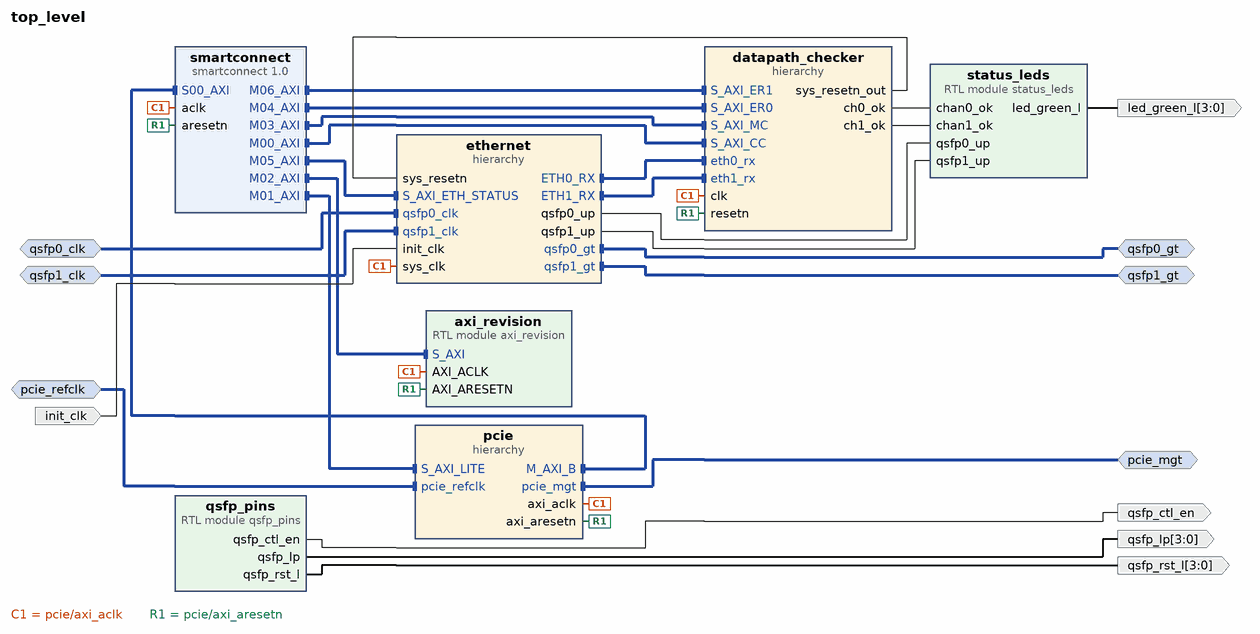
[diagram p0: block diagram of the top level]
# Vivado block design top_level, xcvu9p-flgb2104-3-e, Vivado 2021.1
create_bd_design top_level

create_bd_intf_port -mode Slave -vlnv xilinx.com:interface:diff_clock_rtl:1.0 pcie_refclk
create_bd_intf_port -mode Master -vlnv xilinx.com:interface:pcie_7x_mgt_rtl:1.0 pcie_mgt
create_bd_intf_port -mode Slave -vlnv xilinx.com:interface:diff_clock_rtl:1.0 qsfp0_clk
set_property -dict {CONFIG.FREQ_HZ 322265625} [get_bd_intf_ports qsfp0_clk]
create_bd_intf_port -mode Master -vlnv xilinx.com:interface:gt_rtl:1.0 qsfp0_gt
create_bd_intf_port -mode Master -vlnv xilinx.com:interface:gt_rtl:1.0 qsfp1_gt
create_bd_intf_port -mode Slave -vlnv xilinx.com:interface:diff_clock_rtl:1.0 qsfp1_clk
set_property -dict {CONFIG.FREQ_HZ 322265625} [get_bd_intf_ports qsfp1_clk]
create_bd_port -dir I -type clk init_clk
set_property -dict {CONFIG.FREQ_HZ 50000000} [get_bd_ports init_clk]
create_bd_port -dir O -from 3 -to 0 led_green_l
create_bd_port -dir O -from 3 -to 0 qsfp_rst_l
create_bd_port -dir O -from 3 -to 0 qsfp_lp
create_bd_port -dir O qsfp_ctl_en

create_bd_cell -type hier pcie
create_bd_cell -type hier ethernet
create_bd_cell -type hier datapath_checker
create_bd_cell -type module -reference axi_revision axi_revision
create_bd_cell -type ip -vlnv xilinx.com:ip:smartconnect:1.0 smartconnect
set_property -dict {CONFIG.NUM_CLKS 1 CONFIG.NUM_MI 7 CONFIG.NUM_SI 2} [get_bd_cells smartconnect]
create_bd_cell -type module -reference status_leds status_leds
create_bd_cell -type module -reference qsfp_pins qsfp_pins

# ---- hierarchy /pcie ----
current_bd_instance /pcie
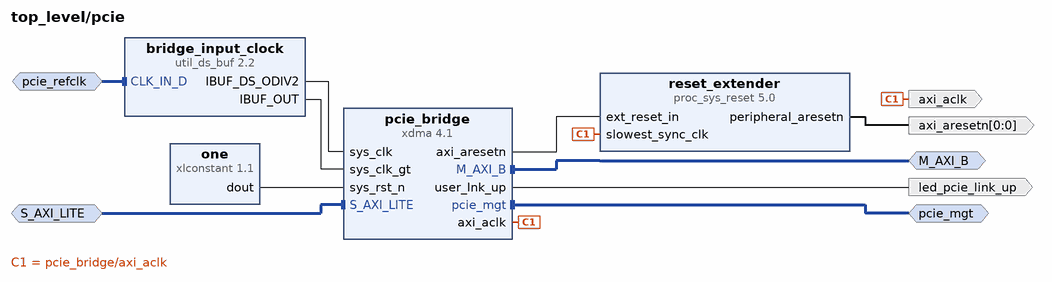
[diagram p1: block diagram inside /pcie]
create_bd_intf_pin -mode Master -vlnv xilinx.com:interface:aximm_rtl:1.0 M_AXI_B
create_bd_intf_pin -mode Slave -vlnv xilinx.com:interface:aximm_rtl:1.0 S_AXI_LITE
create_bd_intf_pin -mode Master -vlnv xilinx.com:interface:pcie_7x_mgt_rtl:1.0 pcie_mgt
create_bd_intf_pin -mode Slave -vlnv xilinx.com:interface:diff_clock_rtl:1.0 pcie_refclk
create_bd_pin -dir O led_pcie_link_up
create_bd_pin -dir O -type clk axi_aclk
create_bd_pin -dir O -from 0 -to 0 -type rst axi_aresetn

create_bd_cell -type ip -vlnv xilinx.com:ip:proc_sys_reset:5.0 reset_extender
create_bd_cell -type ip -vlnv xilinx.com:ip:util_ds_buf:2.2 bridge_input_clock
set_property -dict {CONFIG.C_BUF_TYPE IBUFDSGTE} [get_bd_cells bridge_input_clock]
create_bd_cell -type ip -vlnv xilinx.com:ip:xdma:4.1 pcie_bridge
set_property -dict [list \
  CONFIG.PF0_DEVICE_ID_mqdma 903F \
  CONFIG.PF0_SRIOV_VF_DEVICE_ID A03F \
  CONFIG.PF2_DEVICE_ID_mqdma 923F \
  CONFIG.PF3_DEVICE_ID_mqdma 933F \
  CONFIG.axi_addr_width 64 \
  CONFIG.axi_data_width 512_bit \
  CONFIG.axisten_freq 250 \
  CONFIG.bridge_burst true \
  CONFIG.dma_reset_source_sel User_Reset \
  CONFIG.en_axi_slave_if false \
  CONFIG.enable_jtag_dbg false \
  CONFIG.functional_mode AXI_Bridge \
  CONFIG.mode_selection Advanced \
  CONFIG.pcie_blk_locn X1Y2 \
  CONFIG.pf0_bar0_scale Megabytes \
  CONFIG.pf0_bar0_size 1 \
  CONFIG.pf0_bar1_enabled true \
  CONFIG.pf0_bar1_scale Megabytes \
  CONFIG.pf0_bar1_size 1 \
  CONFIG.pf0_device_id 903F \
  CONFIG.pl_link_cap_max_link_speed 8.0_GT/s \
  CONFIG.pl_link_cap_max_link_width X16 \
  CONFIG.plltype QPLL1 \
] [get_bd_cells pcie_bridge]
create_bd_cell -type ip -vlnv xilinx.com:ip:xlconstant:1.1 one

# ---- hierarchy /ethernet ----
current_bd_instance /ethernet
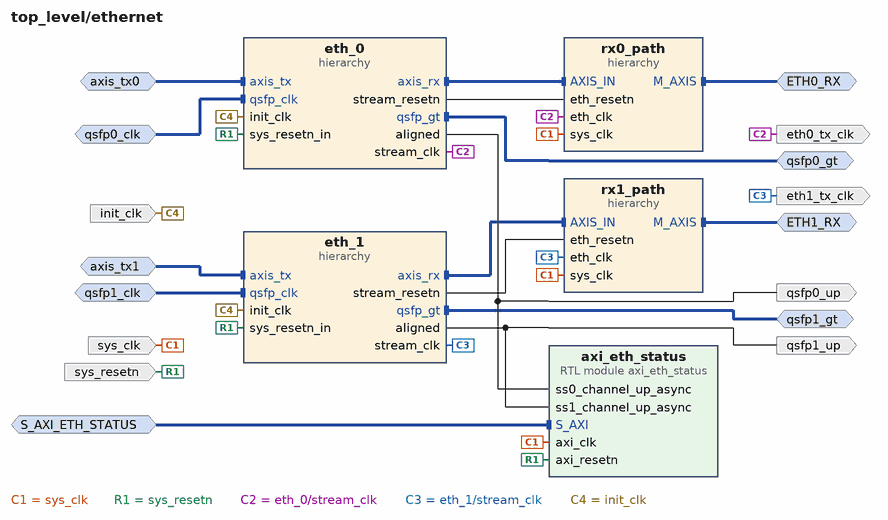
[diagram p2: block diagram inside /ethernet]
create_bd_intf_pin -mode Master -vlnv xilinx.com:interface:gt_rtl:1.0 qsfp1_gt
create_bd_intf_pin -mode Slave -vlnv xilinx.com:interface:diff_clock_rtl:1.0 qsfp1_clk
create_bd_intf_pin -mode Slave -vlnv xilinx.com:interface:axis_rtl:1.0 axis_tx1
create_bd_intf_pin -mode Master -vlnv xilinx.com:interface:gt_rtl:1.0 qsfp0_gt
create_bd_intf_pin -mode Slave -vlnv xilinx.com:interface:diff_clock_rtl:1.0 qsfp0_clk
create_bd_intf_pin -mode Slave -vlnv xilinx.com:interface:axis_rtl:1.0 axis_tx0
create_bd_intf_pin -mode Slave -vlnv xilinx.com:interface:aximm_rtl:1.0 S_AXI_ETH_STATUS
create_bd_intf_pin -mode Master -vlnv xilinx.com:interface:axis_rtl:1.0 ETH0_RX
create_bd_intf_pin -mode Master -vlnv xilinx.com:interface:axis_rtl:1.0 ETH1_RX
create_bd_pin -dir O -type clk eth1_tx_clk
create_bd_pin -dir O qsfp1_up
create_bd_pin -dir O -type clk eth0_tx_clk
create_bd_pin -dir O qsfp0_up
create_bd_pin -dir I sys_clk
create_bd_pin -dir I sys_resetn
create_bd_pin -dir I -type clk init_clk

create_bd_cell -type hier eth_1
create_bd_cell -type hier eth_0
create_bd_cell -type hier rx0_path
create_bd_cell -type hier rx1_path
create_bd_cell -type module -reference axi_eth_status axi_eth_status

# ---- hierarchy /ethernet/eth_1 ----
current_bd_instance /ethernet/eth_1
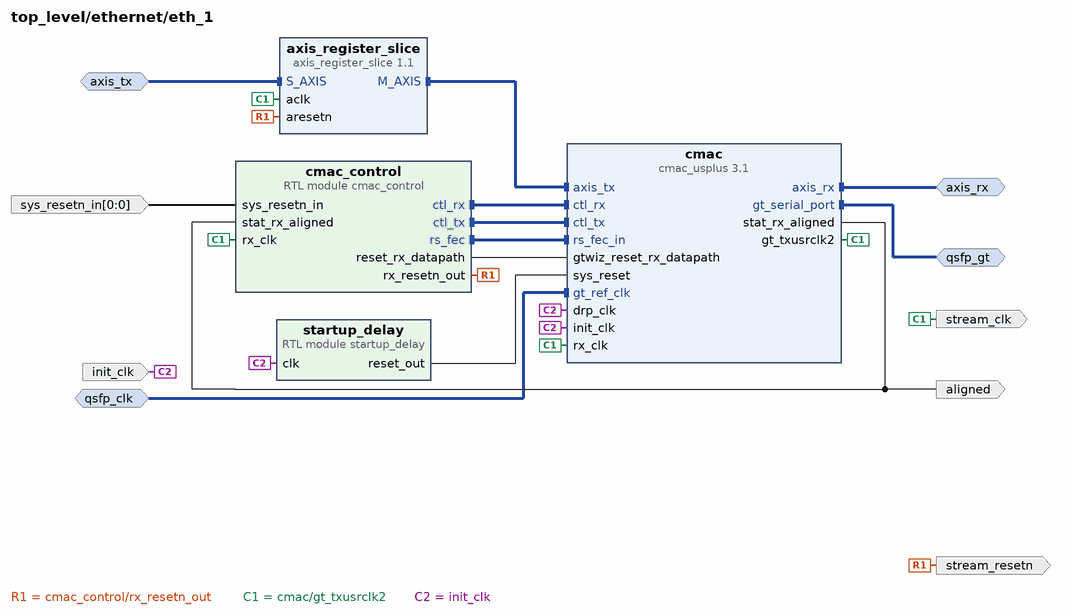
[diagram p3: block diagram inside /ethernet/eth_1]
create_bd_intf_pin -mode Master -vlnv xilinx.com:interface:gt_rtl:1.0 qsfp_gt
create_bd_intf_pin -mode Slave -vlnv xilinx.com:interface:diff_clock_rtl:1.0 qsfp_clk
create_bd_intf_pin -mode Slave -vlnv xilinx.com:interface:axis_rtl:1.0 axis_tx
create_bd_intf_pin -mode Master -vlnv xilinx.com:interface:axis_rtl:1.0 axis_rx
create_bd_pin -dir O -type clk stream_clk
create_bd_pin -dir O aligned
create_bd_pin -dir I init_clk
create_bd_pin -dir I -from 0 -to 0 sys_resetn_in
create_bd_pin -dir O stream_resetn

create_bd_cell -type ip -vlnv xilinx.com:ip:axis_register_slice:1.1 axis_register_slice
create_bd_cell -type ip -vlnv xilinx.com:ip:cmac_usplus:3.1 cmac
set_property -dict [list \
  CONFIG.CMAC_CAUI4_MODE 1 \
  CONFIG.CMAC_CORE_SELECT CMACE4_X0Y2 \
  CONFIG.GT_DRP_CLK 100 \
  CONFIG.GT_GROUP_SELECT {X0Y12~X0Y15} \
  CONFIG.GT_REF_CLK_FREQ 322.265625 \
  CONFIG.INCLUDE_RS_FEC 1 \
  CONFIG.NUM_LANES 4x25 \
  CONFIG.RX_FLOW_CONTROL 0 \
  CONFIG.RX_GT_BUFFER 1 \
  CONFIG.TX_FLOW_CONTROL 0 \
  CONFIG.USER_INTERFACE AXIS \
] [get_bd_cells cmac]
create_bd_cell -type module -reference cmac_control cmac_control
create_bd_cell -type module -reference startup_delay startup_delay

# ---- hierarchy /ethernet/eth_0 ----
current_bd_instance /ethernet/eth_0
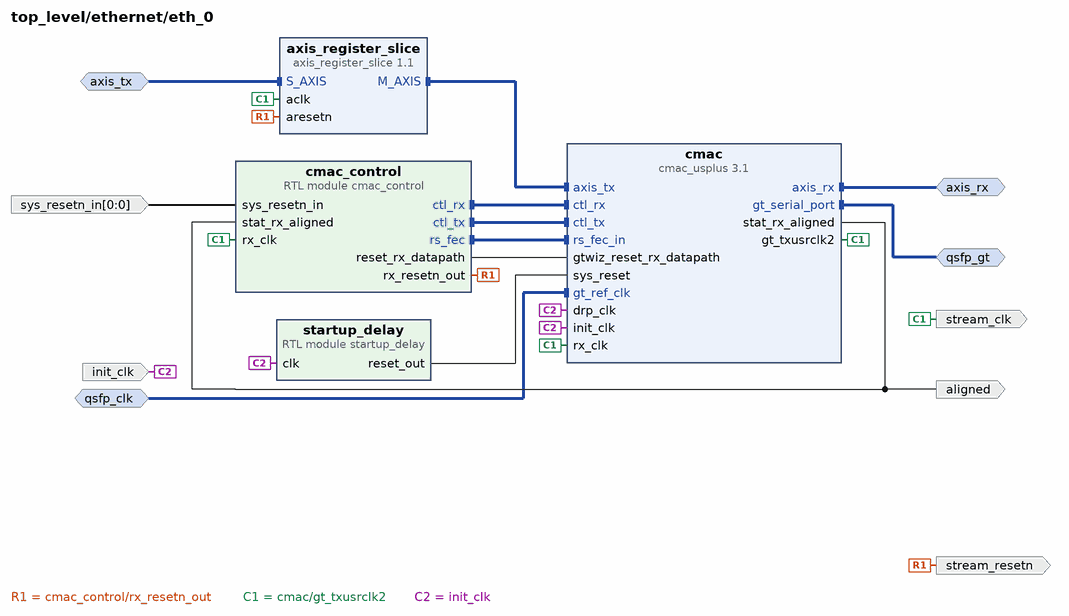
[diagram p4: block diagram inside /ethernet/eth_0]
create_bd_intf_pin -mode Master -vlnv xilinx.com:interface:gt_rtl:1.0 qsfp_gt
create_bd_intf_pin -mode Slave -vlnv xilinx.com:interface:diff_clock_rtl:1.0 qsfp_clk
create_bd_intf_pin -mode Slave -vlnv xilinx.com:interface:axis_rtl:1.0 axis_tx
create_bd_intf_pin -mode Master -vlnv xilinx.com:interface:axis_rtl:1.0 axis_rx
create_bd_pin -dir O -type clk stream_clk
create_bd_pin -dir O aligned
create_bd_pin -dir I -type clk init_clk
create_bd_pin -dir I -from 0 -to 0 sys_resetn_in
create_bd_pin -dir O stream_resetn

create_bd_cell -type ip -vlnv xilinx.com:ip:axis_register_slice:1.1 axis_register_slice
create_bd_cell -type module -reference cmac_control cmac_control
create_bd_cell -type ip -vlnv xilinx.com:ip:cmac_usplus:3.1 cmac
set_property -dict [list \
  CONFIG.CMAC_CAUI4_MODE 1 \
  CONFIG.CMAC_CORE_SELECT CMACE4_X0Y1 \
  CONFIG.GT_DRP_CLK 50 \
  CONFIG.GT_GROUP_SELECT {X0Y4~X0Y7} \
  CONFIG.GT_REF_CLK_FREQ 322.265625 \
  CONFIG.INCLUDE_RS_FEC 1 \
  CONFIG.NUM_LANES 4x25 \
  CONFIG.RX_FLOW_CONTROL 0 \
  CONFIG.RX_GT_BUFFER 1 \
  CONFIG.TX_FLOW_CONTROL 0 \
  CONFIG.USER_INTERFACE AXIS \
] [get_bd_cells cmac]
create_bd_cell -type module -reference startup_delay startup_delay

# ---- hierarchy /ethernet/rx0_path ----
current_bd_instance /ethernet/rx0_path
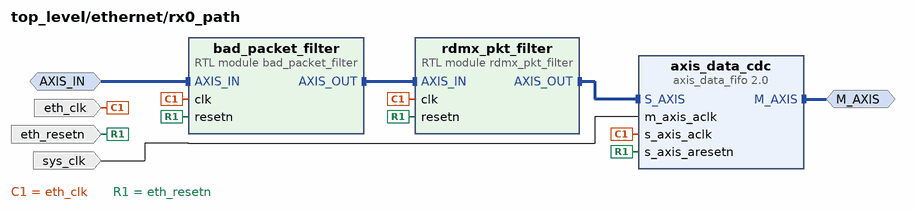
[diagram p5: block diagram inside /ethernet/rx0_path]
create_bd_intf_pin -mode Slave -vlnv xilinx.com:interface:axis_rtl:1.0 AXIS_IN
create_bd_intf_pin -mode Master -vlnv xilinx.com:interface:axis_rtl:1.0 M_AXIS
create_bd_pin -dir I eth_clk
create_bd_pin -dir I eth_resetn
create_bd_pin -dir I sys_clk

create_bd_cell -type ip -vlnv xilinx.com:ip:axis_data_fifo:2.0 axis_data_cdc
set_property -dict {CONFIG.FIFO_DEPTH 256 CONFIG.IS_ACLK_ASYNC 1} [get_bd_cells axis_data_cdc]
create_bd_cell -type module -reference bad_packet_filter bad_packet_filter
set_property -dict {CONFIG.MARK_ONLY_MODE 1} [get_bd_cells bad_packet_filter]
create_bd_cell -type module -reference rdmx_pkt_filter rdmx_pkt_filter

# ---- hierarchy /ethernet/rx1_path ----
current_bd_instance /ethernet/rx1_path
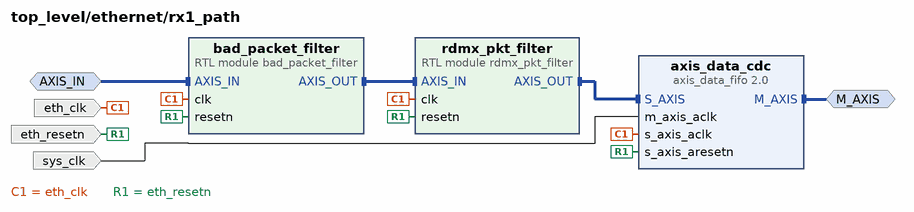
[diagram p6: block diagram inside /ethernet/rx1_path]
create_bd_intf_pin -mode Slave -vlnv xilinx.com:interface:axis_rtl:1.0 AXIS_IN
create_bd_intf_pin -mode Master -vlnv xilinx.com:interface:axis_rtl:1.0 M_AXIS
create_bd_pin -dir I eth_clk
create_bd_pin -dir I eth_resetn
create_bd_pin -dir I sys_clk

create_bd_cell -type ip -vlnv xilinx.com:ip:axis_data_fifo:2.0 axis_data_cdc
set_property -dict {CONFIG.FIFO_DEPTH 256 CONFIG.IS_ACLK_ASYNC 1} [get_bd_cells axis_data_cdc]
create_bd_cell -type module -reference bad_packet_filter bad_packet_filter
set_property -dict {CONFIG.MARK_ONLY_MODE 1} [get_bd_cells bad_packet_filter]
create_bd_cell -type module -reference rdmx_pkt_filter rdmx_pkt_filter

# ---- hierarchy /datapath_checker ----
current_bd_instance /datapath_checker
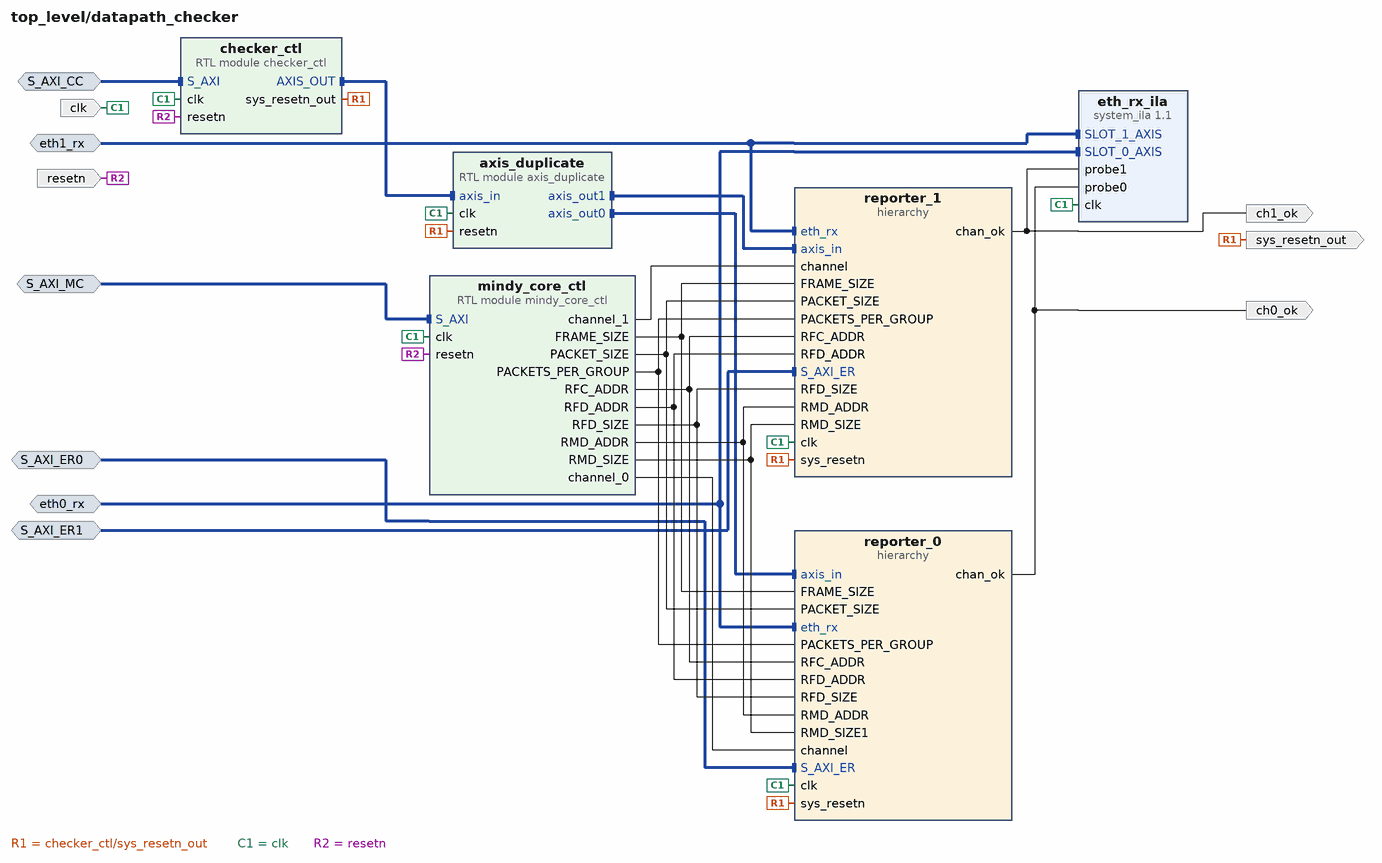
[diagram p7: block diagram inside /datapath_checker]
create_bd_intf_pin -mode Slave -vlnv xilinx.com:interface:aximm_rtl:1.0 S_AXI_CC
create_bd_intf_pin -mode Slave -vlnv xilinx.com:interface:axis_rtl:1.0 eth0_rx
create_bd_intf_pin -mode Slave -vlnv xilinx.com:interface:axis_rtl:1.0 eth1_rx
create_bd_intf_pin -mode Slave -vlnv xilinx.com:interface:aximm_rtl:1.0 S_AXI_MC
create_bd_intf_pin -mode Slave -vlnv xilinx.com:interface:aximm_rtl:1.0 S_AXI_ER0
create_bd_intf_pin -mode Slave -vlnv xilinx.com:interface:aximm_rtl:1.0 S_AXI_ER1
create_bd_pin -dir I -type clk clk
create_bd_pin -dir I -type rst resetn
create_bd_pin -dir O sys_resetn_out
create_bd_pin -dir O ch0_ok
create_bd_pin -dir O ch1_ok

create_bd_cell -type hier reporter_0
create_bd_cell -type hier reporter_1
create_bd_cell -type module -reference axis_duplicate axis_duplicate
create_bd_cell -type module -reference checker_ctl checker_ctl
create_bd_cell -type module -reference mindy_core_ctl mindy_core_ctl
create_bd_cell -type ip -vlnv xilinx.com:ip:system_ila:1.1 eth_rx_ila
set_property -dict [list \
  CONFIG.C_DATA_DEPTH 2048 \
  CONFIG.C_MON_TYPE MIX \
  CONFIG.C_NUM_MONITOR_SLOTS 2 \
  CONFIG.C_NUM_OF_PROBES 2 \
  CONFIG.C_SLOT 1 \
  CONFIG.C_SLOT_0_INTF_TYPE xilinx.com:interface:axis_rtl:1.0 \
  CONFIG.C_SLOT_1_INTF_TYPE xilinx.com:interface:axis_rtl:1.0 \
] [get_bd_cells eth_rx_ila]

# ---- hierarchy /datapath_checker/reporter_0 ----
current_bd_instance /datapath_checker/reporter_0
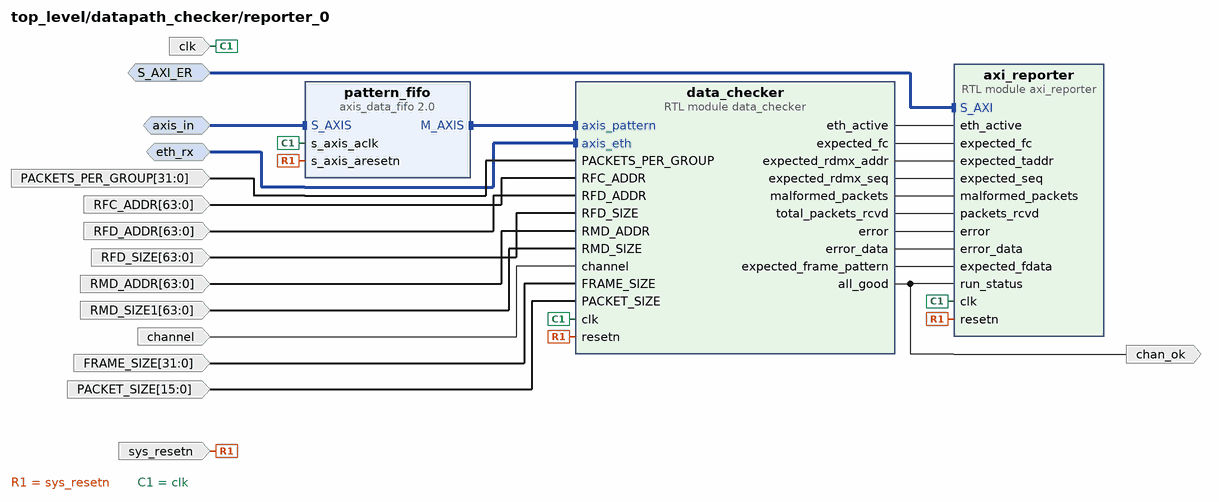
[diagram p8: block diagram inside /datapath_checker/reporter_0]
create_bd_intf_pin -mode Slave -vlnv xilinx.com:interface:axis_rtl:1.0 eth_rx
create_bd_intf_pin -mode Slave -vlnv xilinx.com:interface:axis_rtl:1.0 axis_in
create_bd_intf_pin -mode Slave -vlnv xilinx.com:interface:aximm_rtl:1.0 S_AXI_ER
create_bd_pin -dir I -type clk clk
create_bd_pin -dir O chan_ok
create_bd_pin -dir I sys_resetn
create_bd_pin -dir I -from 15 -to 0 PACKET_SIZE
create_bd_pin -dir I -from 31 -to 0 FRAME_SIZE
create_bd_pin -dir I -from 63 -to 0 RFD_ADDR
create_bd_pin -dir I -from 63 -to 0 RFD_SIZE
create_bd_pin -dir I -from 63 -to 0 RMD_ADDR
create_bd_pin -dir I -from 63 -to 0 RMD_SIZE1
create_bd_pin -dir I -from 63 -to 0 RFC_ADDR
create_bd_pin -dir I -from 31 -to 0 PACKETS_PER_GROUP
create_bd_pin -dir I channel

create_bd_cell -type module -reference axi_reporter axi_reporter
create_bd_cell -type ip -vlnv xilinx.com:ip:axis_data_fifo:2.0 pattern_fifo
create_bd_cell -type module -reference data_checker data_checker

# ---- hierarchy /datapath_checker/reporter_1 ----
current_bd_instance /datapath_checker/reporter_1
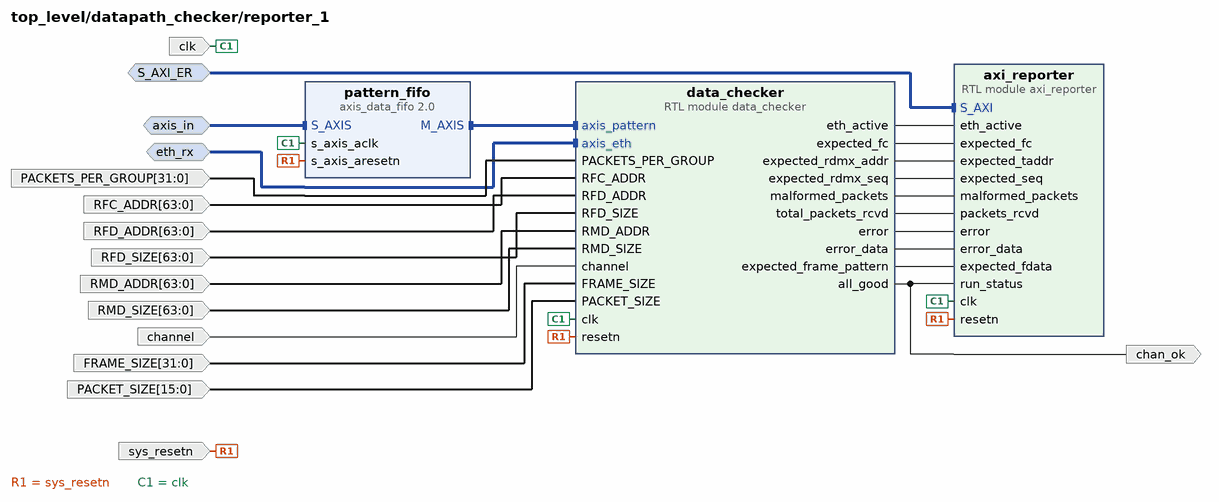
[diagram p9: block diagram inside /datapath_checker/reporter_1]
create_bd_intf_pin -mode Slave -vlnv xilinx.com:interface:axis_rtl:1.0 eth_rx
create_bd_intf_pin -mode Slave -vlnv xilinx.com:interface:axis_rtl:1.0 axis_in
create_bd_intf_pin -mode Slave -vlnv xilinx.com:interface:aximm_rtl:1.0 S_AXI_ER
create_bd_pin -dir I -type clk clk
create_bd_pin -dir O chan_ok
create_bd_pin -dir I sys_resetn
create_bd_pin -dir I -from 15 -to 0 PACKET_SIZE
create_bd_pin -dir I -from 31 -to 0 FRAME_SIZE
create_bd_pin -dir I -from 63 -to 0 RFD_ADDR
create_bd_pin -dir I -from 63 -to 0 RFD_SIZE
create_bd_pin -dir I -from 63 -to 0 RMD_ADDR
create_bd_pin -dir I -from 63 -to 0 RMD_SIZE
create_bd_pin -dir I -from 63 -to 0 RFC_ADDR
create_bd_pin -dir I -from 31 -to 0 PACKETS_PER_GROUP
create_bd_pin -dir I channel

create_bd_cell -type module -reference axi_reporter axi_reporter
create_bd_cell -type module -reference data_checker data_checker
create_bd_cell -type ip -vlnv xilinx.com:ip:axis_data_fifo:2.0 pattern_fifo

# ---- connections ----

current_bd_instance /pcie
connect_bd_intf_net [get_bd_intf_pins pcie_refclk] [get_bd_intf_pins bridge_input_clock/CLK_IN_D]
connect_bd_intf_net [get_bd_intf_pins S_AXI_LITE] [get_bd_intf_pins pcie_bridge/S_AXI_LITE]
connect_bd_intf_net [get_bd_intf_pins M_AXI_B] [get_bd_intf_pins pcie_bridge/M_AXI_B]
connect_bd_intf_net [get_bd_intf_pins pcie_mgt] [get_bd_intf_pins pcie_bridge/pcie_mgt]
connect_bd_net [get_bd_pins bridge_input_clock/IBUF_DS_ODIV2] [get_bd_pins pcie_bridge/sys_clk]
connect_bd_net [get_bd_pins bridge_input_clock/IBUF_OUT] [get_bd_pins pcie_bridge/sys_clk_gt]
connect_bd_net [get_bd_pins one/dout] [get_bd_pins pcie_bridge/sys_rst_n]
connect_bd_net [get_bd_pins pcie_bridge/axi_aresetn] [get_bd_pins reset_extender/ext_reset_in]
connect_bd_net -net proc_sys_reset_0_peripheral_aresetn [get_bd_pins reset_extender/peripheral_aresetn] [get_bd_pins axi_aresetn]
connect_bd_net -net xdma_0_axi_aclk [get_bd_pins pcie_bridge/axi_aclk] [get_bd_pins axi_aclk] [get_bd_pins reset_extender/slowest_sync_clk]
connect_bd_net -net xdma_0_user_lnk_up [get_bd_pins pcie_bridge/user_lnk_up] [get_bd_pins led_pcie_link_up]

current_bd_instance /ethernet
connect_bd_intf_net [get_bd_intf_pins S_AXI_ETH_STATUS] [get_bd_intf_pins axi_eth_status/S_AXI]
connect_bd_intf_net [get_bd_intf_pins axis_tx0] [get_bd_intf_pins eth_0/axis_tx]
connect_bd_intf_net [get_bd_intf_pins axis_tx1] [get_bd_intf_pins eth_1/axis_tx]
connect_bd_intf_net [get_bd_intf_pins qsfp0_gt] [get_bd_intf_pins eth_0/qsfp_gt]
connect_bd_intf_net [get_bd_intf_pins rx0_path/AXIS_IN] [get_bd_intf_pins eth_0/axis_rx]
connect_bd_intf_net [get_bd_intf_pins rx1_path/AXIS_IN] [get_bd_intf_pins eth_1/axis_rx]
connect_bd_intf_net [get_bd_intf_pins qsfp1_gt] [get_bd_intf_pins eth_1/qsfp_gt]
connect_bd_intf_net [get_bd_intf_pins qsfp0_clk] [get_bd_intf_pins eth_0/qsfp_clk]
connect_bd_intf_net [get_bd_intf_pins qsfp1_clk] [get_bd_intf_pins eth_1/qsfp_clk]
connect_bd_intf_net [get_bd_intf_pins ETH0_RX] [get_bd_intf_pins rx0_path/M_AXIS]
connect_bd_intf_net [get_bd_intf_pins ETH1_RX] [get_bd_intf_pins rx1_path/M_AXIS]
connect_bd_net -net axi_clk_1 [get_bd_pins sys_clk] [get_bd_pins rx0_path/sys_clk] [get_bd_pins rx1_path/sys_clk] [get_bd_pins axi_eth_status/axi_clk]
connect_bd_net -net axi_resetn_1 [get_bd_pins sys_resetn] \
  [get_bd_pins eth_0/sys_resetn_in] [get_bd_pins eth_1/sys_resetn_in] [get_bd_pins axi_eth_status/axi_resetn]
connect_bd_net -net eth_0_stat_rx_aligned_0 [get_bd_pins eth_0/aligned] [get_bd_pins qsfp0_up] [get_bd_pins axi_eth_status/ss0_channel_up_async]
connect_bd_net [get_bd_pins eth_0/stream_clk] [get_bd_pins eth0_tx_clk] [get_bd_pins rx0_path/eth_clk]
connect_bd_net [get_bd_pins eth_0/stream_resetn] [get_bd_pins rx0_path/eth_resetn]
connect_bd_net -net eth_1_stat_rx_aligned_0 [get_bd_pins eth_1/aligned] [get_bd_pins qsfp1_up] [get_bd_pins axi_eth_status/ss1_channel_up_async]
connect_bd_net [get_bd_pins eth_1/stream_clk] [get_bd_pins eth1_tx_clk] [get_bd_pins rx1_path/eth_clk]
connect_bd_net [get_bd_pins eth_1/stream_resetn] [get_bd_pins rx1_path/eth_resetn]
connect_bd_net -net init_clk_0_1 [get_bd_pins init_clk] [get_bd_pins eth_0/init_clk] [get_bd_pins eth_1/init_clk]

current_bd_instance /ethernet/eth_1
connect_bd_intf_net [get_bd_intf_pins axis_register_slice/M_AXIS] [get_bd_intf_pins cmac/axis_tx]
connect_bd_intf_net [get_bd_intf_pins axis_tx] [get_bd_intf_pins axis_register_slice/S_AXIS]
connect_bd_intf_net [get_bd_intf_pins cmac_control/ctl_rx] [get_bd_intf_pins cmac/ctl_rx]
connect_bd_intf_net [get_bd_intf_pins cmac_control/ctl_tx] [get_bd_intf_pins cmac/ctl_tx]
connect_bd_intf_net [get_bd_intf_pins cmac_control/rs_fec] [get_bd_intf_pins cmac/rs_fec_in]
connect_bd_intf_net [get_bd_intf_pins axis_rx] [get_bd_intf_pins cmac/axis_rx]
connect_bd_intf_net [get_bd_intf_pins qsfp_gt] [get_bd_intf_pins cmac/gt_serial_port]
connect_bd_intf_net [get_bd_intf_pins qsfp_clk] [get_bd_intf_pins cmac/gt_ref_clk]
connect_bd_net [get_bd_pins cmac_control/reset_rx_datapath] [get_bd_pins cmac/gtwiz_reset_rx_datapath]
connect_bd_net -net cmac_control_sys_resetn_out [get_bd_pins cmac_control/rx_resetn_out] \
  [get_bd_pins stream_resetn] [get_bd_pins axis_register_slice/aresetn]
connect_bd_net -net cmac_gt_rxusrclk2 [get_bd_pins cmac/gt_txusrclk2] \
  [get_bd_pins stream_clk] [get_bd_pins axis_register_slice/aclk] [get_bd_pins cmac/rx_clk] [get_bd_pins cmac_control/rx_clk]
connect_bd_net [get_bd_pins cmac/stat_rx_aligned] [get_bd_pins aligned] [get_bd_pins cmac_control/stat_rx_aligned]
connect_bd_net [get_bd_pins init_clk] [get_bd_pins cmac/init_clk] [get_bd_pins cmac/drp_clk] [get_bd_pins startup_delay/clk]
connect_bd_net [get_bd_pins startup_delay/reset_out] [get_bd_pins cmac/sys_reset]
connect_bd_net [get_bd_pins sys_resetn_in] [get_bd_pins cmac_control/sys_resetn_in]

current_bd_instance /ethernet/eth_0
connect_bd_intf_net [get_bd_intf_pins axis_register_slice/M_AXIS] [get_bd_intf_pins cmac/axis_tx]
connect_bd_intf_net [get_bd_intf_pins axis_tx] [get_bd_intf_pins axis_register_slice/S_AXIS]
connect_bd_intf_net [get_bd_intf_pins cmac_control/ctl_rx] [get_bd_intf_pins cmac/ctl_rx]
connect_bd_intf_net [get_bd_intf_pins cmac_control/ctl_tx] [get_bd_intf_pins cmac/ctl_tx]
connect_bd_intf_net [get_bd_intf_pins cmac_control/rs_fec] [get_bd_intf_pins cmac/rs_fec_in]
connect_bd_intf_net [get_bd_intf_pins axis_rx] [get_bd_intf_pins cmac/axis_rx]
connect_bd_intf_net [get_bd_intf_pins qsfp_gt] [get_bd_intf_pins cmac/gt_serial_port]
connect_bd_intf_net [get_bd_intf_pins qsfp_clk] [get_bd_intf_pins cmac/gt_ref_clk]
connect_bd_net [get_bd_pins cmac_control/reset_rx_datapath] [get_bd_pins cmac/gtwiz_reset_rx_datapath]
connect_bd_net -net cmac_control_sys_resetn_out [get_bd_pins cmac_control/rx_resetn_out] \
  [get_bd_pins stream_resetn] [get_bd_pins axis_register_slice/aresetn]
connect_bd_net -net cmac_gt_rxusrclk2 [get_bd_pins cmac/gt_txusrclk2] \
  [get_bd_pins stream_clk] [get_bd_pins axis_register_slice/aclk] [get_bd_pins cmac_control/rx_clk] [get_bd_pins cmac/rx_clk]
connect_bd_net [get_bd_pins cmac/stat_rx_aligned] [get_bd_pins aligned] [get_bd_pins cmac_control/stat_rx_aligned]
connect_bd_net -net init_clk_0_1 [get_bd_pins init_clk] [get_bd_pins cmac/init_clk] [get_bd_pins cmac/drp_clk] [get_bd_pins startup_delay/clk]
connect_bd_net [get_bd_pins startup_delay/reset_out] [get_bd_pins cmac/sys_reset]
connect_bd_net [get_bd_pins sys_resetn_in] [get_bd_pins cmac_control/sys_resetn_in]

current_bd_instance /ethernet/rx0_path
connect_bd_intf_net [get_bd_intf_pins AXIS_IN] [get_bd_intf_pins bad_packet_filter/AXIS_IN]
connect_bd_intf_net [get_bd_intf_pins M_AXIS] [get_bd_intf_pins axis_data_cdc/M_AXIS]
connect_bd_intf_net [get_bd_intf_pins bad_packet_filter/AXIS_OUT] [get_bd_intf_pins rdmx_pkt_filter/AXIS_IN]
connect_bd_intf_net [get_bd_intf_pins axis_data_cdc/S_AXIS] [get_bd_intf_pins rdmx_pkt_filter/AXIS_OUT]
connect_bd_net -net clk_1 [get_bd_pins eth_clk] \
  [get_bd_pins axis_data_cdc/s_axis_aclk] [get_bd_pins bad_packet_filter/clk] [get_bd_pins rdmx_pkt_filter/clk]
connect_bd_net -net resetn_cdc_dest_arst [get_bd_pins eth_resetn] \
  [get_bd_pins axis_data_cdc/s_axis_aresetn] [get_bd_pins bad_packet_filter/resetn] [get_bd_pins rdmx_pkt_filter/resetn]
connect_bd_net [get_bd_pins sys_clk] [get_bd_pins axis_data_cdc/m_axis_aclk]

current_bd_instance /ethernet/rx1_path
connect_bd_intf_net [get_bd_intf_pins AXIS_IN] [get_bd_intf_pins bad_packet_filter/AXIS_IN]
connect_bd_intf_net [get_bd_intf_pins M_AXIS] [get_bd_intf_pins axis_data_cdc/M_AXIS]
connect_bd_intf_net [get_bd_intf_pins bad_packet_filter/AXIS_OUT] [get_bd_intf_pins rdmx_pkt_filter/AXIS_IN]
connect_bd_intf_net [get_bd_intf_pins axis_data_cdc/S_AXIS] [get_bd_intf_pins rdmx_pkt_filter/AXIS_OUT]
connect_bd_net -net clk_1 [get_bd_pins eth_clk] \
  [get_bd_pins axis_data_cdc/s_axis_aclk] [get_bd_pins bad_packet_filter/clk] [get_bd_pins rdmx_pkt_filter/clk]
connect_bd_net -net resetn_cdc_dest_arst [get_bd_pins eth_resetn] \
  [get_bd_pins axis_data_cdc/s_axis_aresetn] [get_bd_pins bad_packet_filter/resetn] [get_bd_pins rdmx_pkt_filter/resetn]
connect_bd_net [get_bd_pins sys_clk] [get_bd_pins axis_data_cdc/m_axis_aclk]

current_bd_instance /datapath_checker
connect_bd_intf_net [get_bd_intf_pins S_AXI_ER1] [get_bd_intf_pins reporter_1/S_AXI_ER]
connect_bd_intf_net [get_bd_intf_pins S_AXI_ER0] [get_bd_intf_pins reporter_0/S_AXI_ER]
connect_bd_intf_net [get_bd_intf_pins S_AXI_MC] [get_bd_intf_pins mindy_core_ctl/S_AXI]
connect_bd_intf_net [get_bd_intf_pins axis_duplicate/axis_out0] [get_bd_intf_pins reporter_0/axis_in]
connect_bd_intf_net [get_bd_intf_pins axis_duplicate/axis_out1] [get_bd_intf_pins reporter_1/axis_in]
connect_bd_intf_net [get_bd_intf_pins eth0_rx] [get_bd_intf_pins reporter_0/eth_rx]
connect_bd_intf_net [get_bd_intf_pins eth0_rx] [get_bd_intf_pins eth_rx_ila/SLOT_0_AXIS]
connect_bd_intf_net [get_bd_intf_pins eth1_rx] [get_bd_intf_pins reporter_1/eth_rx]
connect_bd_intf_net [get_bd_intf_pins eth1_rx] [get_bd_intf_pins eth_rx_ila/SLOT_1_AXIS]
connect_bd_intf_net [get_bd_intf_pins axis_duplicate/axis_in] [get_bd_intf_pins checker_ctl/AXIS_OUT]
connect_bd_intf_net [get_bd_intf_pins S_AXI_CC] [get_bd_intf_pins checker_ctl/S_AXI]
connect_bd_net -net ch0_ok [get_bd_pins reporter_0/chan_ok] [get_bd_pins ch0_ok] [get_bd_pins eth_rx_ila/probe0]
connect_bd_net -net ch1_ok [get_bd_pins reporter_1/chan_ok] [get_bd_pins ch1_ok] [get_bd_pins eth_rx_ila/probe1]
connect_bd_net [get_bd_pins checker_ctl/sys_resetn_out] \
  [get_bd_pins sys_resetn_out] [get_bd_pins reporter_0/sys_resetn] [get_bd_pins reporter_1/sys_resetn] \
  [get_bd_pins axis_duplicate/resetn]
connect_bd_net -net mindy_core_ctl_0_FRAME_SIZE [get_bd_pins mindy_core_ctl/FRAME_SIZE] \
  [get_bd_pins reporter_0/FRAME_SIZE] [get_bd_pins reporter_1/FRAME_SIZE]
connect_bd_net -net mindy_core_ctl_0_PACKET_SIZE [get_bd_pins mindy_core_ctl/PACKET_SIZE] \
  [get_bd_pins reporter_0/PACKET_SIZE] [get_bd_pins reporter_1/PACKET_SIZE]
connect_bd_net [get_bd_pins mindy_core_ctl/PACKETS_PER_GROUP] [get_bd_pins reporter_0/PACKETS_PER_GROUP] [get_bd_pins reporter_1/PACKETS_PER_GROUP]
connect_bd_net [get_bd_pins mindy_core_ctl/RFC_ADDR] [get_bd_pins reporter_0/RFC_ADDR] [get_bd_pins reporter_1/RFC_ADDR]
connect_bd_net [get_bd_pins mindy_core_ctl/RFD_ADDR] [get_bd_pins reporter_0/RFD_ADDR] [get_bd_pins reporter_1/RFD_ADDR]
connect_bd_net [get_bd_pins mindy_core_ctl/RFD_SIZE] [get_bd_pins reporter_0/RFD_SIZE] [get_bd_pins reporter_1/RFD_SIZE]
connect_bd_net [get_bd_pins mindy_core_ctl/RMD_ADDR] [get_bd_pins reporter_0/RMD_ADDR] [get_bd_pins reporter_1/RMD_ADDR]
connect_bd_net [get_bd_pins mindy_core_ctl/RMD_SIZE] [get_bd_pins reporter_0/RMD_SIZE1] [get_bd_pins reporter_1/RMD_SIZE]
connect_bd_net [get_bd_pins mindy_core_ctl/channel_0] [get_bd_pins reporter_0/channel]
connect_bd_net [get_bd_pins mindy_core_ctl/channel_1] [get_bd_pins reporter_1/channel]
connect_bd_net -net pcie_axi_aclk [get_bd_pins clk] \
  [get_bd_pins reporter_0/clk] [get_bd_pins reporter_1/clk] [get_bd_pins axis_duplicate/clk] [get_bd_pins checker_ctl/clk] \
  [get_bd_pins mindy_core_ctl/clk] [get_bd_pins eth_rx_ila/clk]
connect_bd_net -net source_200Mhz_resetn [get_bd_pins resetn] [get_bd_pins checker_ctl/resetn] [get_bd_pins mindy_core_ctl/resetn]

current_bd_instance /datapath_checker/reporter_0
connect_bd_intf_net [get_bd_intf_pins S_AXI_ER] [get_bd_intf_pins axi_reporter/S_AXI]
connect_bd_intf_net [get_bd_intf_pins axis_in] [get_bd_intf_pins pattern_fifo/S_AXIS]
connect_bd_intf_net [get_bd_intf_pins data_checker/axis_pattern] [get_bd_intf_pins pattern_fifo/M_AXIS]
connect_bd_intf_net [get_bd_intf_pins eth_rx] [get_bd_intf_pins data_checker/axis_eth]
connect_bd_net [get_bd_pins PACKETS_PER_GROUP] [get_bd_pins data_checker/PACKETS_PER_GROUP]
connect_bd_net [get_bd_pins RFC_ADDR] [get_bd_pins data_checker/RFC_ADDR]
connect_bd_net [get_bd_pins RFD_ADDR] [get_bd_pins data_checker/RFD_ADDR]
connect_bd_net [get_bd_pins RFD_SIZE] [get_bd_pins data_checker/RFD_SIZE]
connect_bd_net [get_bd_pins RMD_ADDR] [get_bd_pins data_checker/RMD_ADDR]
connect_bd_net -net RMD_SIZE1_1 [get_bd_pins RMD_SIZE1] [get_bd_pins data_checker/RMD_SIZE]
connect_bd_net [get_bd_pins channel] [get_bd_pins data_checker/channel]
connect_bd_net -net checker_ctl_sys_resetn_out [get_bd_pins sys_resetn] \
  [get_bd_pins axi_reporter/resetn] [get_bd_pins pattern_fifo/s_axis_aresetn] [get_bd_pins data_checker/resetn]
connect_bd_net [get_bd_pins data_checker/eth_active] [get_bd_pins axi_reporter/eth_active]
connect_bd_net [get_bd_pins data_checker/expected_fc] [get_bd_pins axi_reporter/expected_fc]
connect_bd_net [get_bd_pins data_checker/expected_rdmx_addr] [get_bd_pins axi_reporter/expected_taddr]
connect_bd_net [get_bd_pins data_checker/expected_rdmx_seq] [get_bd_pins axi_reporter/expected_seq]
connect_bd_net [get_bd_pins data_checker/malformed_packets] [get_bd_pins axi_reporter/malformed_packets]
connect_bd_net [get_bd_pins data_checker/total_packets_rcvd] [get_bd_pins axi_reporter/packets_rcvd]
connect_bd_net -net ila0_all_good [get_bd_pins data_checker/all_good] [get_bd_pins chan_ok] [get_bd_pins axi_reporter/run_status]
connect_bd_net -net ila0_error [get_bd_pins data_checker/error] [get_bd_pins axi_reporter/error]
connect_bd_net -net ila0_error_data [get_bd_pins data_checker/error_data] [get_bd_pins axi_reporter/error_data]
connect_bd_net -net ila0_expected_frame_pattern [get_bd_pins data_checker/expected_frame_pattern] [get_bd_pins axi_reporter/expected_fdata]
connect_bd_net -net mindy_core_ctl_0_FRAME_SIZE [get_bd_pins FRAME_SIZE] [get_bd_pins data_checker/FRAME_SIZE]
connect_bd_net -net mindy_core_ctl_0_PACKET_SIZE [get_bd_pins PACKET_SIZE] [get_bd_pins data_checker/PACKET_SIZE]
connect_bd_net -net pcie_axi_aclk [get_bd_pins clk] \
  [get_bd_pins axi_reporter/clk] [get_bd_pins pattern_fifo/s_axis_aclk] [get_bd_pins data_checker/clk]

current_bd_instance /datapath_checker/reporter_1
connect_bd_intf_net [get_bd_intf_pins S_AXI_ER] [get_bd_intf_pins axi_reporter/S_AXI]
connect_bd_intf_net [get_bd_intf_pins axis_in] [get_bd_intf_pins pattern_fifo/S_AXIS]
connect_bd_intf_net [get_bd_intf_pins data_checker/axis_pattern] [get_bd_intf_pins pattern_fifo/M_AXIS]
connect_bd_intf_net [get_bd_intf_pins eth_rx] [get_bd_intf_pins data_checker/axis_eth]
connect_bd_net [get_bd_pins PACKETS_PER_GROUP] [get_bd_pins data_checker/PACKETS_PER_GROUP]
connect_bd_net [get_bd_pins RFC_ADDR] [get_bd_pins data_checker/RFC_ADDR]
connect_bd_net [get_bd_pins RFD_ADDR] [get_bd_pins data_checker/RFD_ADDR]
connect_bd_net [get_bd_pins RFD_SIZE] [get_bd_pins data_checker/RFD_SIZE]
connect_bd_net [get_bd_pins RMD_ADDR] [get_bd_pins data_checker/RMD_ADDR]
connect_bd_net [get_bd_pins RMD_SIZE] [get_bd_pins data_checker/RMD_SIZE]
connect_bd_net [get_bd_pins channel] [get_bd_pins data_checker/channel]
connect_bd_net -net checker_ctl_sys_resetn_out [get_bd_pins sys_resetn] \
  [get_bd_pins axi_reporter/resetn] [get_bd_pins data_checker/resetn] [get_bd_pins pattern_fifo/s_axis_aresetn]
connect_bd_net [get_bd_pins data_checker/eth_active] [get_bd_pins axi_reporter/eth_active]
connect_bd_net [get_bd_pins data_checker/expected_fc] [get_bd_pins axi_reporter/expected_fc]
connect_bd_net [get_bd_pins data_checker/expected_rdmx_addr] [get_bd_pins axi_reporter/expected_taddr]
connect_bd_net [get_bd_pins data_checker/expected_rdmx_seq] [get_bd_pins axi_reporter/expected_seq]
connect_bd_net [get_bd_pins data_checker/malformed_packets] [get_bd_pins axi_reporter/malformed_packets]
connect_bd_net [get_bd_pins data_checker/total_packets_rcvd] [get_bd_pins axi_reporter/packets_rcvd]
connect_bd_net -net ila1_all_good [get_bd_pins data_checker/all_good] [get_bd_pins chan_ok] [get_bd_pins axi_reporter/run_status]
connect_bd_net -net ila1_error [get_bd_pins data_checker/error] [get_bd_pins axi_reporter/error]
connect_bd_net -net ila1_error_data [get_bd_pins data_checker/error_data] [get_bd_pins axi_reporter/error_data]
connect_bd_net -net ila1_expected_frame_pattern [get_bd_pins data_checker/expected_frame_pattern] [get_bd_pins axi_reporter/expected_fdata]
connect_bd_net -net mindy_core_ctl_0_FRAME_SIZE [get_bd_pins FRAME_SIZE] [get_bd_pins data_checker/FRAME_SIZE]
connect_bd_net -net mindy_core_ctl_0_PACKET_SIZE [get_bd_pins PACKET_SIZE] [get_bd_pins data_checker/PACKET_SIZE]
connect_bd_net -net pcie_axi_aclk [get_bd_pins clk] \
  [get_bd_pins axi_reporter/clk] [get_bd_pins data_checker/clk] [get_bd_pins pattern_fifo/s_axis_aclk]

current_bd_instance /
connect_bd_intf_net [get_bd_intf_pins datapath_checker/S_AXI_ER1] [get_bd_intf_pins smartconnect/M06_AXI]
connect_bd_intf_net [get_bd_intf_pins datapath_checker/S_AXI_ER0] [get_bd_intf_pins smartconnect/M04_AXI]
connect_bd_intf_net [get_bd_intf_pins datapath_checker/S_AXI_MC] [get_bd_intf_pins smartconnect/M03_AXI]
connect_bd_intf_net [get_bd_intf_ports qsfp0_gt] [get_bd_intf_pins ethernet/qsfp0_gt]
connect_bd_intf_net [get_bd_intf_ports qsfp1_gt] [get_bd_intf_pins ethernet/qsfp1_gt]
connect_bd_intf_net [get_bd_intf_pins ethernet/ETH0_RX] [get_bd_intf_pins datapath_checker/eth0_rx]
connect_bd_intf_net [get_bd_intf_pins ethernet/ETH1_RX] [get_bd_intf_pins datapath_checker/eth1_rx]
connect_bd_intf_net [get_bd_intf_ports qsfp0_clk] [get_bd_intf_pins ethernet/qsfp0_clk]
connect_bd_intf_net [get_bd_intf_ports pcie_refclk] [get_bd_intf_pins pcie/pcie_refclk]
connect_bd_intf_net [get_bd_intf_ports qsfp1_clk] [get_bd_intf_pins ethernet/qsfp1_clk]
connect_bd_intf_net [get_bd_intf_pins pcie/S_AXI_LITE] [get_bd_intf_pins smartconnect/M01_AXI]
connect_bd_intf_net [get_bd_intf_pins datapath_checker/S_AXI_CC] [get_bd_intf_pins smartconnect/M00_AXI]
connect_bd_intf_net [get_bd_intf_pins axi_revision/S_AXI] [get_bd_intf_pins smartconnect/M02_AXI]
connect_bd_intf_net [get_bd_intf_pins smartconnect/M05_AXI] [get_bd_intf_pins ethernet/S_AXI_ETH_STATUS]
connect_bd_intf_net [get_bd_intf_pins pcie/M_AXI_B] [get_bd_intf_pins smartconnect/S00_AXI]
connect_bd_intf_net [get_bd_intf_ports pcie_mgt] [get_bd_intf_pins pcie/pcie_mgt]
connect_bd_net -net axi_resetn_1 [get_bd_pins datapath_checker/sys_resetn_out] [get_bd_pins ethernet/sys_resetn]
connect_bd_net -net datapath_checker_chan0_ok [get_bd_pins datapath_checker/ch0_ok] [get_bd_pins status_leds/chan0_ok]
connect_bd_net -net datapath_checker_chan1_ok [get_bd_pins datapath_checker/ch1_ok] [get_bd_pins status_leds/chan1_ok]
connect_bd_net [get_bd_pins ethernet/qsfp0_up] [get_bd_pins status_leds/qsfp0_up]
connect_bd_net [get_bd_pins ethernet/qsfp1_up] [get_bd_pins status_leds/qsfp1_up]
connect_bd_net -net init_clk_0_1 [get_bd_ports init_clk] [get_bd_pins ethernet/init_clk]
connect_bd_net [get_bd_pins pcie/axi_aclk] \
  [get_bd_pins ethernet/sys_clk] [get_bd_pins datapath_checker/clk] [get_bd_pins axi_revision/AXI_ACLK] \
  [get_bd_pins smartconnect/aclk]
connect_bd_net [get_bd_pins qsfp_pins/qsfp_ctl_en] [get_bd_ports qsfp_ctl_en]
connect_bd_net [get_bd_pins qsfp_pins/qsfp_lp] [get_bd_ports qsfp_lp]
connect_bd_net [get_bd_pins qsfp_pins/qsfp_rst_l] [get_bd_ports qsfp_rst_l]
connect_bd_net -net source_200Mhz_resetn [get_bd_pins pcie/axi_aresetn] \
  [get_bd_pins datapath_checker/resetn] [get_bd_pins axi_revision/AXI_ARESETN] [get_bd_pins smartconnect/aresetn]
connect_bd_net [get_bd_pins status_leds/led_green_l] [get_bd_ports led_green_l]

# ---- address map ----
assign_bd_address -offset 0x0000000000000000 -range 256 -target_address_space [get_bd_addr_spaces pcie/pcie_bridge/M_AXI_B] [get_bd_addr_segs axi_revision/S_AXI/reg0]
assign_bd_address -offset 0x0000000000000500 -range 256 -target_address_space [get_bd_addr_spaces pcie/pcie_bridge/M_AXI_B] [get_bd_addr_segs ethernet/axi_eth_status/S_AXI/reg0]
assign_bd_address -offset 0x0000000000001000 -range 256 -target_address_space [get_bd_addr_spaces pcie/pcie_bridge/M_AXI_B] [get_bd_addr_segs datapath_checker/checker_ctl/S_AXI/reg0]
assign_bd_address -offset 0x0000000000002000 -range 256 -target_address_space [get_bd_addr_spaces pcie/pcie_bridge/M_AXI_B] [get_bd_addr_segs datapath_checker/mindy_core_ctl/S_AXI/reg0]
assign_bd_address -offset 0x0000000000003000 -range 256 -target_address_space [get_bd_addr_spaces pcie/pcie_bridge/M_AXI_B] [get_bd_addr_segs datapath_checker/reporter_0/axi_reporter/S_AXI/reg0]
assign_bd_address -offset 0x0000000000004000 -range 256 -target_address_space [get_bd_addr_spaces pcie/pcie_bridge/M_AXI_B] [get_bd_addr_segs datapath_checker/reporter_1/axi_reporter/S_AXI/reg0]
assign_bd_address -offset 0x0000000100000000 -range 64K -target_address_space [get_bd_addr_spaces pcie/pcie_bridge/M_AXI_B] [get_bd_addr_segs pcie/pcie_bridge/S_AXI_LITE/CTL0]

validate_bd_design
save_bd_design
